# EAGLE design P-431_MIDI_IN_NANO (EAGLE 6.0)
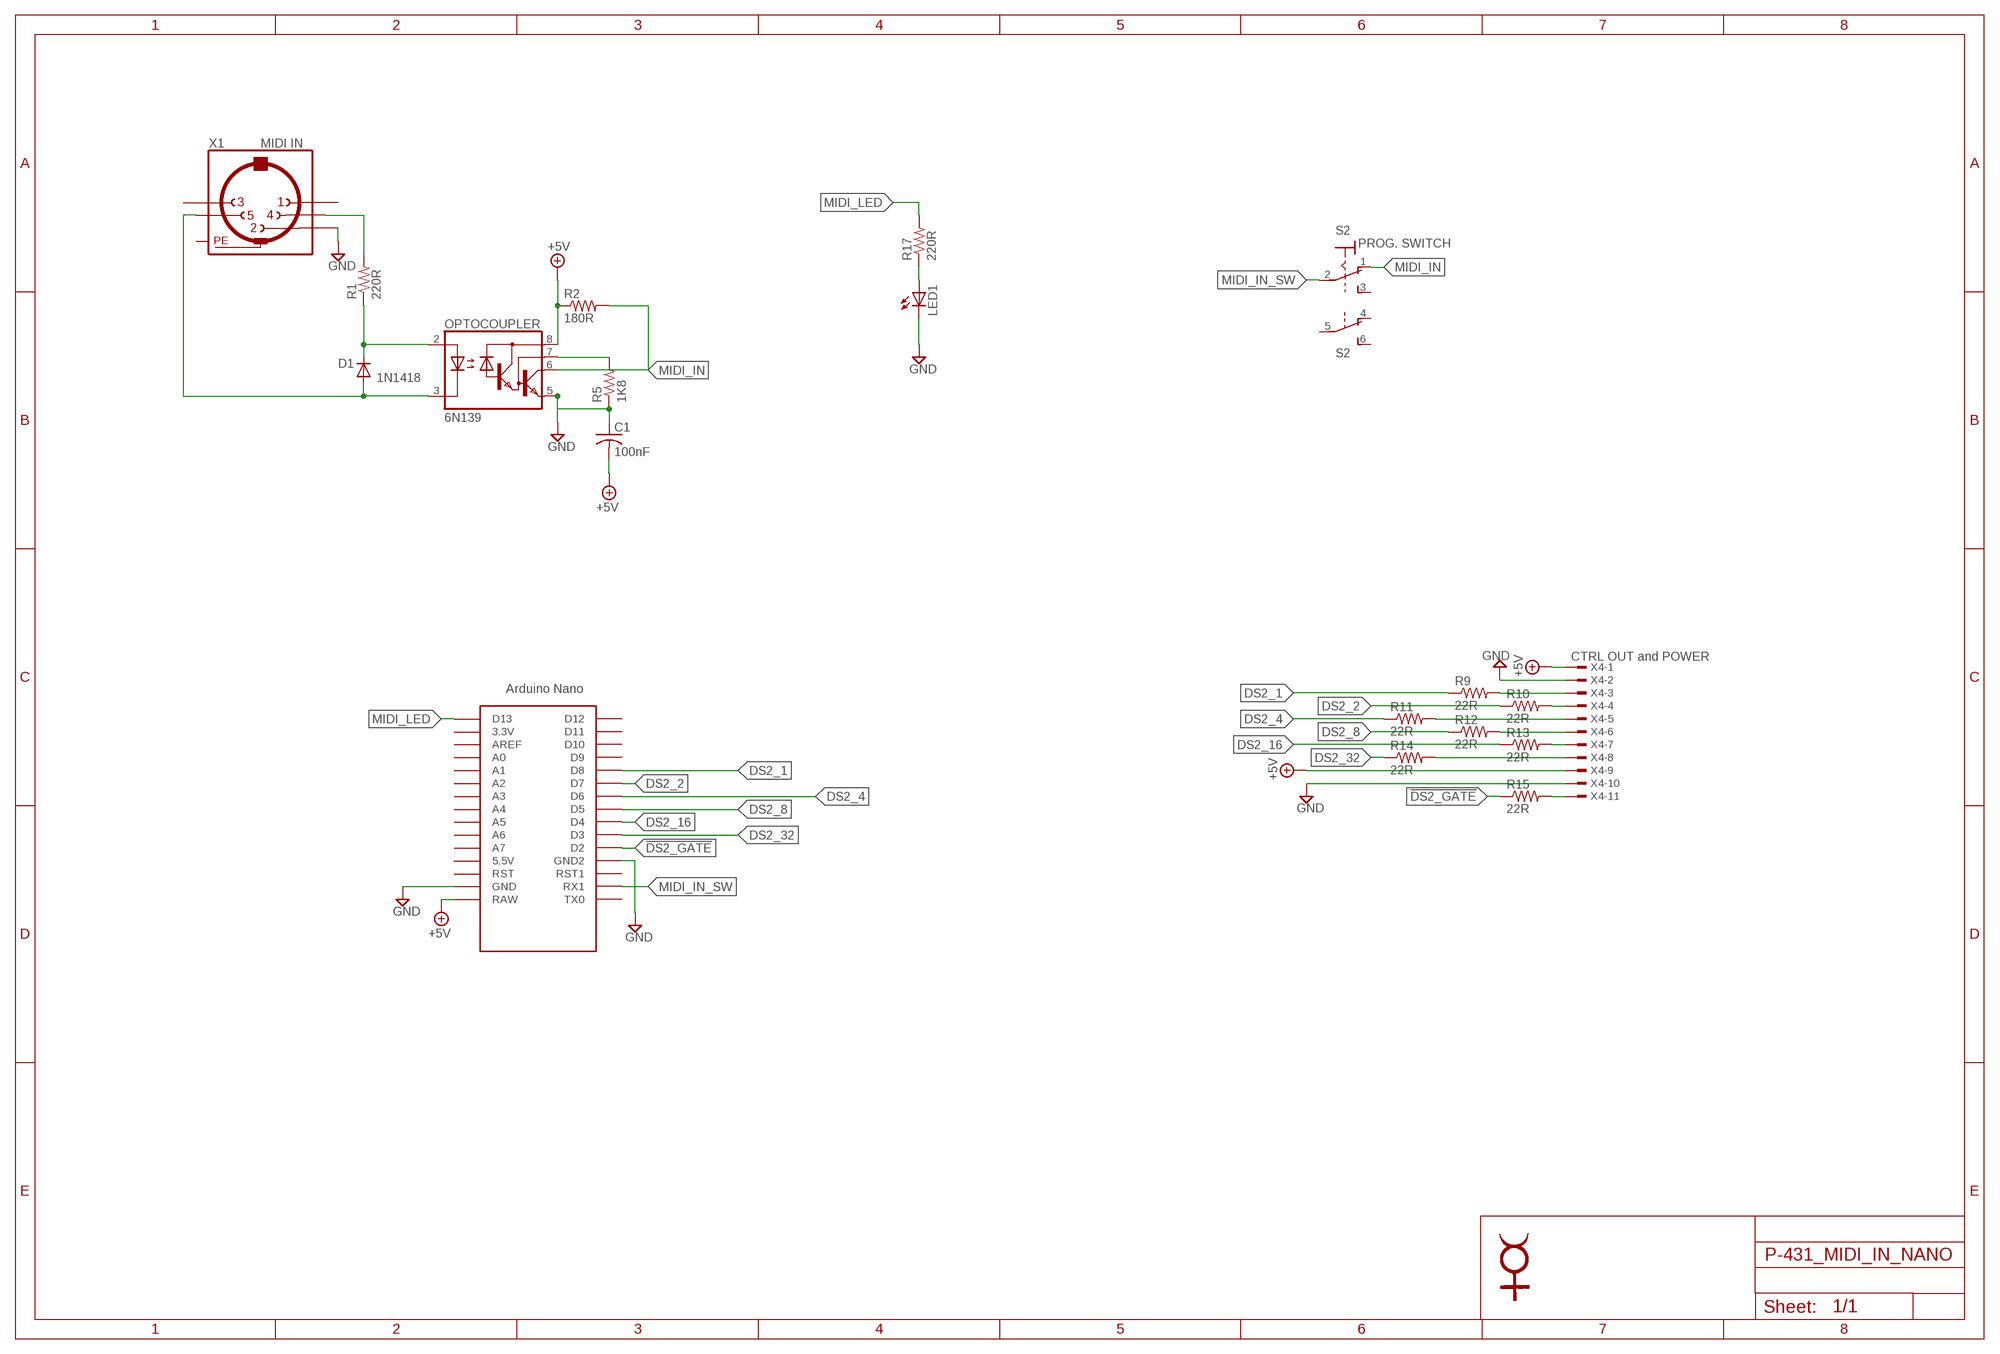
[diagram p0: schematic, sheet 1]
FRAME1 (A3L-LOC): AUTHOR_NAME: Alessio Degani; NOTES: Crumar P-431 MIDI

## Parts
C1  100nF  C-US050-025X075  [C050-025X075]
D1  1N1418  DIODE1N4148  [DIODE-1N4148]
LED1  LED5MM  [LED5MM]
OPTOCOUPLER  6N139  6N138  [DIL08]
R1  220R  R-US_0207/7  [0207/7]
R2  180R  R-US_0207/7  [0207/7]
R5  1K8  R-US_0207/7  [0207/7]
R9  22R  R-US_0207/7  [0207/7]
R10  22R  R-US_0207/7  [0207/7]
R11  22R  R-US_0207/7  [0207/7]
R12  22R  R-US_0207/7  [0207/7]
R13  22R  R-US_0207/7  [0207/7]
R14  22R  R-US_0207/7  [0207/7]
R15  22R  R-US_0207/7  [0207/7]
R17  220R  R-US_0207/7  [0207/7]
S2  PROG. SWITCH  320-938  [320-938]
U$1  NANO  [NANO]
X1  MIDI IN  MAB5SH  [MAB5SH]
X4  CTRL OUT and POWER  TSW-111-02-S-S-RA  [TSW-111-02-S-S-RA]

## Nets
!DS2_GATE: R15.1 U$1.D2
+5V: C1.2 OPTOCOUPLER.8(VCC) R2.1 U$1.RAW X4.1 X4.9
DS2_1: R9.1 U$1.D8
DS2_2: R10.1 U$1.D7
DS2_4: R11.1 U$1.D6
DS2_8: R12.1 U$1.D5
DS2_16: R13.1 U$1.D4
DS2_32: R14.1 U$1.D3
GND: C1.1 LED1.K(C) OPTOCOUPLER.5(GND) R5.1 U$1.GND U$1.GND1(GND2) X1.2 X4.2 X4.10
MIDI_IN: OPTOCOUPLER.6(VO) R2.2 S2.1(1:O)
MIDI_IN_SW: S2.2(1:P) U$1.RX1
MIDI_LED: R17.2 U$1.D13
N$1: D1.A OPTOCOUPLER.3(C) X1.5
N$2: D1.C OPTOCOUPLER.2(A) R1.1
N$3: R1.2 X1.4
N$4: OPTOCOUPLER.7(VB) R5.2
N$8: LED1.A R17.1
N$19: R9.2 X4.3
N$20: R10.2 X4.4
N$21: R11.2 X4.5
N$22: R12.2 X4.6
N$23: R13.2 X4.7
N$24: R14.2 X4.8
N$25: R15.2 X4.11
Unconnected: S2.3(1:S) S2.4(B:O) S2.5(B:P) S2.6(B:S) U$1.3.3V U$1.5V(5.5V) U$1.A0 U$1.A1 U$1.A2 U$1.A3 U$1.A4 U$1.A5 U$1.A6 U$1.A7 U$1.AREF U$1.D9 U$1.D10 U$1.D11 U$1.D12 U$1.ICSP1 U$1.ICSP2 U$1.ICSP3 U$1.ICSP4 U$1.ICSP5 U$1.ICSP6 U$1.RST U$1.RST1 U$1.TX0 X1.1 X1.3

## Power pins joined to a net without a drawn wire
PE: X1.PE X1.PE@(PE)

## Library data of the parts
C1 = rcl:C-US: CAPACITOR, American symbol
D1 = SparkFun:DIODE: Diode These are standard reverse protection diodes and small signal diodes. SMA package can handle up to about 1A. SOD-323 can handle about 200mA. What the SOD-323 package when ordering, there are some mfgs out there that are 5-pin packages.
LED1 = led:LED: LED OSRAM: - CHIPLED LG R971, LG N971, LY N971, LG Q971, LY Q971, LO R971, LY R971 LH N974, LH R974 LS Q976, LO Q976, LY Q976 LO Q996 - Hyper CHIPLED LW Q18S LB Q993, LB Q99A, LB R99A - SideLED LS A670, LO A670, LY A670, LG A670, LP A670 LB A673, LV A673, LT A673, LW A673 LH A674 LY A675 LS A676, LA A676, LO A676, LY A676, LW A676 LS A679, LY A679, LG A679 - Hyper Micro SIDELED® LS Y876, LA Y876, LO Y876, LY Y876 LT Y87S - SmartLED LW L88C, LW L88S LB L89C, LB L89S, LG L890 LS L89K, LO L89K, LY L89K LS L896, LA L896, LO L896, LY L896 - TOPLED LS T670, LO T670, LY T670, LG T670, LP T670 LSG T670, LSP T670, LSY T670, LOP T670, LYG T670 LG T671, LOG T671, LSG T671 LB T673, LV T673, LT T673, LW T673 LH T674 LS T676, LA T676, LO T676, LY T676, LB T676, LH T676, LSB T676, LW T676 LB T67C, LV T67C, LT T67C, LS T67K, LO T67K, LY T67K, LW E67C LS E67B, LA E67B, LO E67B, LY E67B, LB E67C, LV E67C, LT E67C LW T67C LS T679, LY T679, LG T679 LS T770, LO T770, LY T770, LG T770, LP T770 LB T773, LV T773, LT T773, LW T773 LH T774 LS E675, LA E675, LY E675, LS T675 LS T776, LA T776, LO T776, LY T776, LB T776 LHGB T686 LT T68C, LB T68C - Hyper Mini TOPLED® LB M676 - Mini TOPLED Santana® LG M470 LS M47K, LO M47K, LY M47K Source: http://www.osram.convergy.de LUXEON: - LUMILED® LXK2-PW12-R00, LXK2-PW12-S00, LXK2-PW14-U00, LXK2-PW14-V00 LXK2-PM12-R00, LXK2-PM12-S00, LXK2-PM14-U00 LXK2-PE12-Q00, LXK2-PE12-R00, LXK2-PE12-S00, LXK2-PE14-T00, LXK2-PE14-U00 LXK2-PB12-K00, LXK2-PB12-L00, LXK2-PB12-M00, LXK2-PB14-N00, LXK2-PB14-P00, LXK2-PB14-Q00 LXK2-PR12-L00, LXK2-PR12-M00, LXK2-PR14-Q00, LXK2-PR14-R00 LXK2-PD12-Q00, LXK2-PD12-R00, LXK2-PD12-S00 LXK2-PH12-R00, LXK2-PH12-S00 LXK2-PL12-P00, LXK2-PL12-Q00, LXK2-PL12-R00 Source: www.luxeon.com KINGBRIGHT: KA-3528ASYC Source: www.kingbright.com
OPTOCOUPLER = optocoupler:6N138: MOTOROLA OPTO COUPLER; MF: VISHAY/TELEFUNKEN; MPN: 6N138; OC_FARNELL: 9860150; OC_NEWARK: 35K5294
R1 R2 R5 R9-R15 R17 = resistor:R-US_: RESISTOR, American symbol
S2 = switch:320-938: TOGGLE SWITCH distributor RS Components
U$1 = Arduino-clone:NANO: Arduino Nano
X1 = con-hirschmann:MAB5SH: Female CONNECTOR 5 pins 90 deg. with shield, horizontal (DIN 41524); OC_FARNELL: 809883; OC_NEWARK: unknown
X4 = con-samtec:TSW-111-02-S-S: THROUGH-HOLE .025" SQ POST HEADER Source: Samtec TSW.pdf; OC_FARNELL: unknown; OC_NEWARK: unknown

## Board
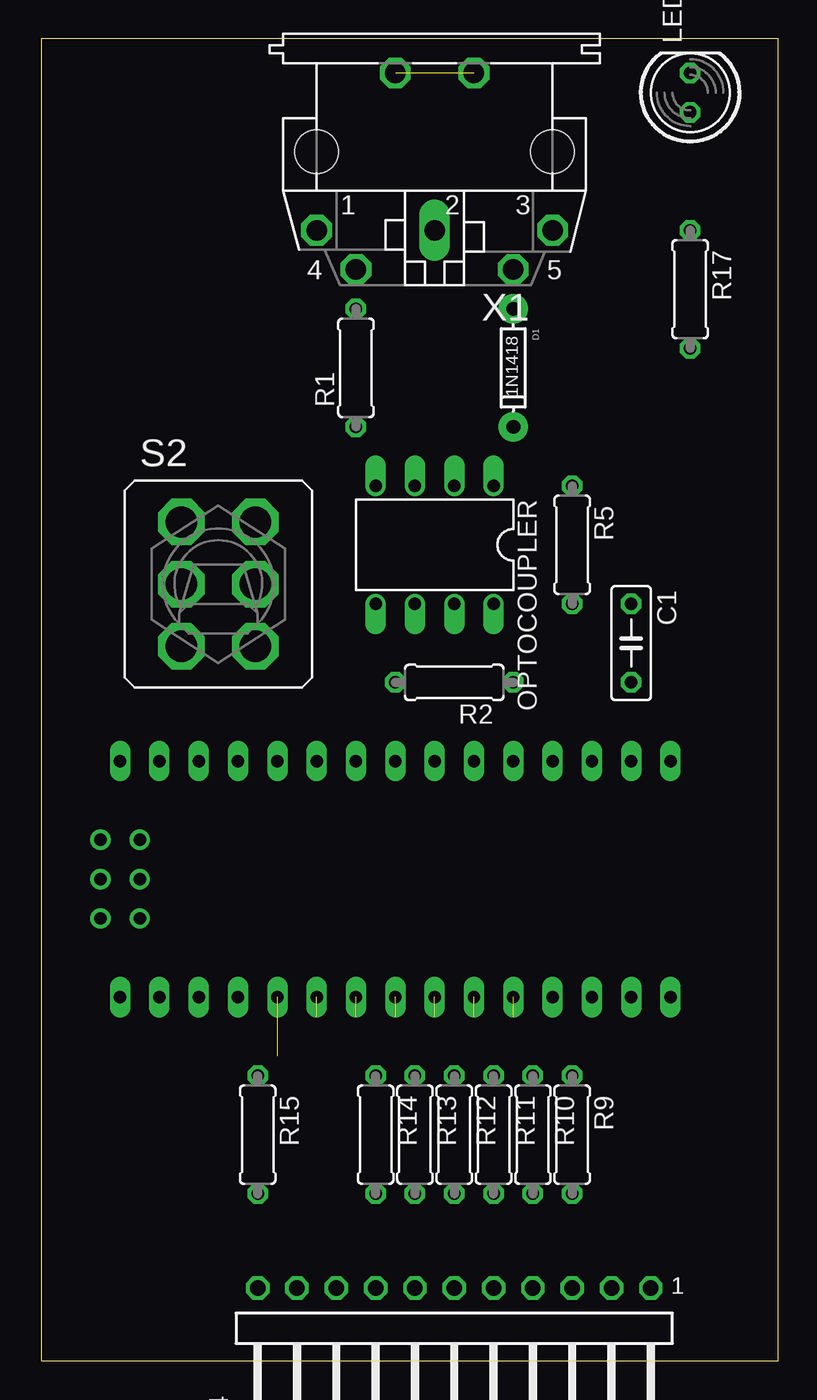
[diagram p1: board, top side]
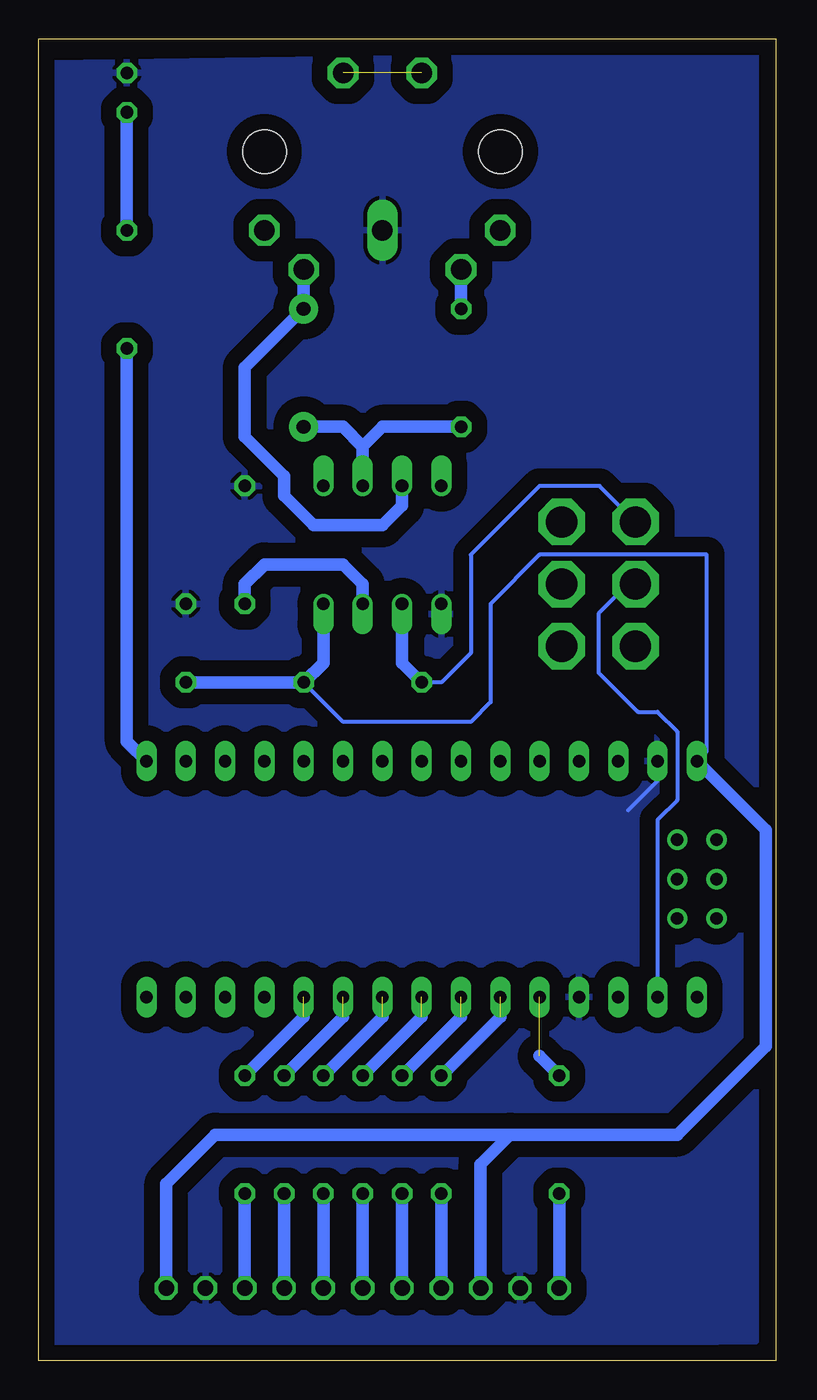
[diagram p2: board, bottom side, seen from below]

Size 47.6 x 85.39 mm. Coordinates in mm from the lower left corner, seen from the top.
Outline: 0,0 47.6,0 47.6,85.39 0,85.39 0,0
Copper layers (1*16): Top 0.035mm / dielectric 1.5mm / Bottom 0.035mm
Design rules: minimum track width 10mil, minimum drill 24mil, track to track 40mil, track to pad 40mil, pad to pad 20mil, via to via 20mil, smd to smd 8mil, copper to edge 40mil, drill to drill 8mil, minimum pad ring 10mil, minimum via ring 8mil, stop-mask expansion 4mil, vias tented up to drill 0mil, thermal gap 10mil

### Footprints (pad centres in the part's own frame; a part is rotated, then mirrored left to right if it is on the bottom)
C050-025X075 = drill 0.813 octagon: 1 -2.54,0; 2 2.54,0
DIODE-1N4148 = drill 0.9 pad 1.88: A -3.81,0; C 3.81,0
LED5MM = drill 0.813 octagon: A -1.27,0; K 1.27,0
DIL08 = drill 0.813 offset: 1 -3.81,-3.81; 2 -1.27,-3.81; 3 1.27,-3.81; 4 3.81,-3.81; 5 3.81,3.81; 6 1.27,3.81; 7 -1.27,3.81; 8 -3.81,3.81
0207/7 = drill 0.813 octagon: 1 -3.81,0; 2 3.81,0
320-938 = drill 2.007 octagon: 1 -2.388,4.013; 2 -2.388,0; 3 -2.388,-4.013; 4 2.388,4.013; 5 2.388,0; 6 2.388,-4.013
NANO = drill 0.8 long: 3.3V -10.16,24.13; 5V -10.16,-1.27; A0 -10.16,19.05; A1 -10.16,16.51; A2 -10.16,13.97; A3 -10.16,11.43; A4 -10.16,8.89; A5 -10.16,6.35; A6 -10.16,3.81; A7 -10.16,1.27; AREF -10.16,21.59; D2 5.08,1.27; D3 5.08,3.81; D4 5.08,6.35; D5 5.08,8.89; D6 5.08,11.43; D7 5.08,13.97; D8 5.08,16.51; D9 5.08,19.05; D10 5.08,21.59; D11 5.08,24.13; D12 5.08,26.67; D13 -10.16,26.67; GND -10.16,-6.35; GND1 5.08,-1.27; RAW -10.16,-8.89; RST -10.16,-3.81; RST1 5.08,-3.81; RX1 5.08,-6.35; TX0 5.08,-8.89 | drill 0.8: ICSP1 -5.08,-10.16; ICSP2 -5.08,-7.62; ICSP3 -2.54,-10.16; ICSP4 -2.54,-7.62; ICSP5 0,-10.16; ICSP6 0,-7.62
MAB5SH = drill 1.321 octagon: 1 7.62,5.08; 3 -7.62,5.08; 4 5.08,7.62; 5 -5.08,7.62; PE -2.54,-5.08; PE@ 2.54,-5.08 | drill 1.321 long: 2 0,5.08 | hole 2.794: 7.62,0; -7.62,0
TSW-111-02-S-S-RA = drill 1 pad 1.5 octagon: 1 12.7,1.524; 2 10.16,1.524; 3 7.62,1.524; 4 5.08,1.524; 5 2.54,1.524; 6 0,1.524; 7 -2.54,1.524; 8 -5.08,1.524; 9 -7.62,1.524; 10 -10.16,1.524; 11 -12.7,1.524

### Placement (x,y rotation side)
C1  38.1,46.35 270 top
D1  30.48,64.14 270 top
LED1  41.91,81.92 90 top
OPTOCOUPLER  25.4,52.7 180 top
R1  20.32,64.14 90 top
R2  26.67,43.81 180 top
R5  34.29,52.7 270 top
R9  34.29,14.61 270 top
R10  31.75,14.61 270 top
R11  29.21,14.61 270 top
R12  26.67,14.61 270 top
R13  24.13,14.61 270 top
R14  21.59,14.61 270 top
R15  13.97,14.61 270 top
R17  41.91,69.22 270 top
S2  11.43,50.16 0 top
U$1  13.97,28.57 270 top
X1  25.4,78.11 180 top
X4  26.67,3.17 0 top

### Tracks (layer width: path | path; a pad name or v marks a point on that pad's centre or on a via)
!DS2_GATE  (1 unrouted)
  Bottom 0.813: R15.1 15.24,19.68
+5V
  Bottom 0.254: U$1.RAW 4.45,39.37 4.45,52.07 15.24,52.07 18.41,48.9 18.41,42.55 19.68,41.27 27.94,41.27 R2.1
  Bottom 0.813: X4.1 39.37,11.43 36.2,14.61 17.14,14.61 | 17.14,14.61 6.35,14.61 0.64,20.32 0.64,34.29 U$1.RAW | X4.9 19.05,12.7 17.14,14.61 | OPTOCOUPLER.8 29.21,45.09 R2.1 C1.2
DS2_1  (1 unrouted)
  Bottom 0.813: R9.1 30.48,22.23
DS2_2  (1 unrouted)
  Bottom 0.813: R10.1 27.94,22.23
DS2_4  (1 unrouted)
  Bottom 0.813: R11.1 25.4,22.23
DS2_8  (1 unrouted)
  Bottom 0.813: R12.1 22.86,22.23
DS2_16  (1 unrouted)
  Bottom 0.813: R13.1 20.32,22.23
DS2_32  (1 unrouted)
  Bottom 0.813: R14.1 17.78,22.23
GND
  Bottom 0.254: U$1.GND 7.62,37.47 9.53,35.56
  pour Bottom: 1.27,84.45 46.99,83.82 46.99,0.64 1.27,1.27
MIDI_IN
  Bottom 0.254: S2.1 11.38,56.52 15.24,56.52 19.68,52.07 19.68,45.72 21.59,43.81 R2.2
  Bottom 0.813: OPTOCOUPLER.6 24.13,45.09 R2.2
MIDI_IN_SW
  Bottom 0.254: S2.2 9.53,50.16 11.43,48.26 11.43,44.45 8.89,41.91 7.62,41.91 6.35,40.64 6.35,36.2 7.62,34.92 U$1.RX1
MIDI_LED
  Bottom 0.813: U$1.D13 41.91,40.01 R17.2
N$1
  Bottom 0.813: X1.5 D1.A 34.29,64.14 34.29,59.69 31.75,57.15 31.75,55.88 29.84,53.98 25.4,53.98 24.13,55.24 OPTOCOUPLER.3
N$2
  Bottom 0.813: R1.1 25.4,60.33 26.67,59.05 | 26.67,59.05 27.94,60.33 D1.C | OPTOCOUPLER.2 26.67,59.05
N$3
  Bottom 0.813: X1.4 R1.2
N$4
  Bottom 0.813: R5.2 34.29,50.16 33.02,51.44 27.94,51.44 26.67,50.16 OPTOCOUPLER.7
N$8
  Bottom 0.813: R17.1 LED1.A
N$19
  Bottom 0.813: X4.3 R9.2
N$20
  Bottom 0.813: X4.4 R10.2
N$21
  Bottom 0.813: X4.5 R11.2
N$22
  Bottom 0.813: X4.6 R12.2
N$23
  Bottom 0.813: X4.7 R13.2
N$24
  Bottom 0.813: X4.8 R14.2
N$25
  Bottom 0.813: X4.11 R15.2
PE  (1 unrouted)